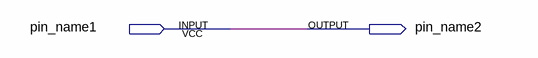
[diagram p0: schematic sheet]
// Quartus schematic top_level_schematic.bdf as structural Verilog: 0 symbols, 2 pins
module top_level_schematic (
  input  pin_name1,
  output pin_name2
);


  assign pin_name2 = pin_name1;
endmodule
